# Altium schematic sheet MAX6698-Temperature-Sensor.SchDoc: MAX6698 Temperature Sensor
size Letter; Author: Tharun Suresh; CompanyName: AlbertaSat; Organization: Altium Limited; Revision: 4.1; SheetNumber: 3; SheetTotal: 4; CopyrightYear: 2019
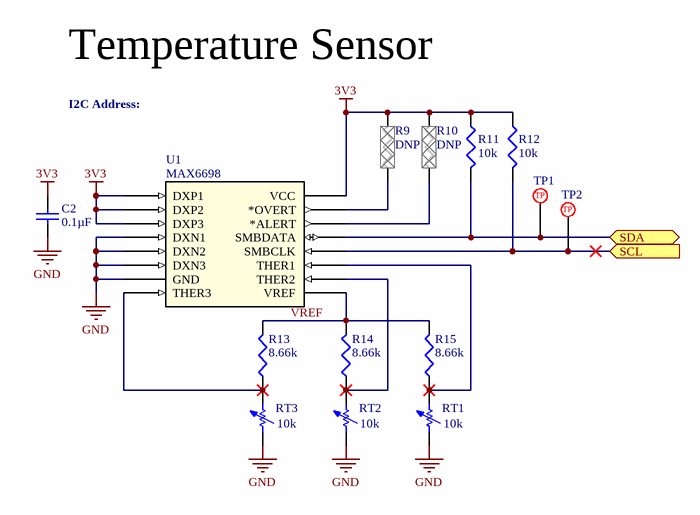
[diagram p0: MAX6698-Temperature-Sensor.SchDoc]

## Parts
C2  value 0.1µF  [TDK-CGA2B]  (hidden comment: Cap)
R9  DNP  [PANA-ERJ2G]  (no BOM)
R10  DNP  [PANA-ERJ2G]  (no BOM)
R11  value 10k  [PANA-ERJ6EN]  (hidden comment: Res3)
R12  value 10k  [PANA-ERJ6EN]  (hidden comment: Res3)
R13  value 8.66k  [PANA-ERA2A]  (hidden comment: Res3)
R14  value 8.66k  [PANA-ERA2A]  (hidden comment: Res3)
R15  value 8.66k  [PANA-ERA2A]  (hidden comment: Res3)
RT1  value 10k  [VSH-1M1002]  (hidden comment: Res Adj1)
RT2  value 10k  [VSH-1M1002]  (hidden comment: Res Adj1)
RT3  value 10k  [VSH-1M1002]  (hidden comment: Res Adj1)
TP1  5017  [KS-5017]  (value not drawn)
TP2  5017  [KS-5017]  (value not drawn)
U1  MAX6698  [MAX-21-0055H-16]

## Ports
SCL (in), SDA (bidir)

## Nets
3V3: C2.2 R9.2 R10.2 R11.1 R12.1 U1.1(DXP1) U1.3(DXP2) U1.5(DXP3) U1.12(VCC)
GND: C2.1 RT1.1 RT2.1 RT3.1 U1.2(DXN1) U1.4(DXN2) U1.6(DXN3) U1.16(GND)
SCL: R12.2 TP2.1 U1.15(SMBCLK) ; port SCL
SDA: R11.2 TP1.1 U1.14(SMBDATA) ; port SDA
VREF: R13.2 R14.2 R15.2 U1.8(VREF)
NetR9_1: R9.1 U1.11(*OVERT)
NetR10_1: R10.1 U1.13(*ALERT)
NetR13_1: R13.1 RT3.2 U1.7(THER3)
NetR14_1: R14.1 RT2.2 U1.9(THER2)
NetR15_1: R15.1 RT1.2 U1.10(THER1)

## Notes on the sheet
- Temperature Sensor
- I2C Address:
- (the "License"); you may not use or redistribute this file except in compliance with the License. You
- This file and the information within it are licensed under the terms of the Apache License, Version 2.0
- Copyright
- Unless required by applicable law or agreed to in writing, content distributed under the License is
- distributed on an "AS IS" BASIS, WITHOUT WARRANTIES OR CONDITIONS OF ANY KIND,
- either express or implied. See the License for the specific language governing permissions and
- limitations under the License.
- may obtain a copy of the License at:
- http://www.apache.org/licenses/LICENSE-2.0
- Title
- Size:
- Date:
- Letter
- Number:
- Time:
- Revision:
- Sheet
- of
- University of Alberta
- Deptartment of Electrical
- and Computer Engineering
- Edmonton AB, Canada
- T6G 1H9
- File:
- (in symbol PTP-KS-00001) TP

## Library data of the parts
C2 = PC-TDK-02262: CAP CER 0.1UF 50V X7R 0402; Manufacturer Part Number: CGA2B3X7R1H104M050BB; Index: 2262; Designator: C?; Tolerance: ±20%; Published: 3/16/2016; LatestRevisionDate: 3/16/2016; LatestRevisionNote: ...; PackageReference: 0402 (1005 Metric); Publisher: AlbertaSat; PackageDescription: Radial Cap, Thru-Hole; 2 Leads; 0.3 in Pin Spacing; Part Number: PC-TDK-02262; Supplier Part Number 1: 445-12271-1-ND; Supplier 1: Digi-key; Supplier Link: http://www.digikey.ca/product-search/en?keywords=445-12271-1-ND; Voltage - Rated: 50V; Temperature Coefficient: X7R; Applications: Automotive
R9 R10 = 19766: Part Number: 19766; Designator: R?; Value: DNP; PackageReference: 0402 (1005 Metric); PackageDescription: Chip Resistor, 2-Leads, Body 1.00x0.50mm, IPC Low Density
R11 R12 = 17208: RES SMD 10K OHM 1% 1/8W 0805; Part Number: 17208; Manufacturer Part Number: ERJ-6ENF1002V; Power: 0.125W, 1/8W; Temperature Coefficient: ±100ppm/°C; Published: 8-Jun-2000; LatestRevisionDate: 29-May-2009; LatestRevisionNote: IPC-7351 Footprint Added.; PackageReference: 0805 (2012 Metric); Publisher: Altium Limited; PackageDescription: Chip Resistor, 2-Leads, Body 2.00x1.25mm, IPC Low Density; Supplier Part Number 1: P10.0KCCT-ND; Supplier 1: Digi-Key; Supplier Link: https://www.digikey.com/product-detail/en/panasonic-electronic-components/ERJ-6ENF1002V/P10.0KCCT-ND/119248; Tolerance: ±1%
R13-R15 = 17098: RES SMD 8.66KOHM 0.1% 1/16W 0402; Part Number: 17098; Manufacturer Part Number: ERA-2ARB8661X; Designator: R?; Power: 0.063W, 1/16W; Temperature Coefficient: ±10ppm/°C; Published: 8-Jun-2000; LatestRevisionDate: 29-May-2009; LatestRevisionNote: IPC-7351 Footprint Added.; PackageReference: 0402 (1005 Metric); Publisher: Altium Limited; PackageDescription: Chip Resistor, 2-Leads, Body 1.00x0.50mm, IPC Low Density; Supplier Part Number 1: P18123CT-ND; Supplier 1: Digi-Key; Supplier Link: http://www.digikey.ca/product-search/en?keywords=P18123CT-ND; Tolerance: ±0.1%
RT1-RT3 = PRT-VSH-00266: NTC THERMISTOR 10K OHM 5% BEAD; Manufacturer Part Number: 01M1002JF; Set Position: 0.5; Index: 266; Power - Rated: 75mW; Published: 5/26/2018; LatestRevisionDate: 5/26/2018; LatestRevisionNote: ...; PackageReference: VSH-1M1002; Publisher: AlbertaSat; PackageDescription: NTC THERMISTOR 10K OHM 5% BEAD; Part Number: PRT-VSH-00266; Supplier Part Number 1: 541-1074-ND; Supplier 1: Digi-key; Supplier Part Number 2: 71-1M1002-A3; Supplier 2: Mouser; Supplier Link: https://www.digikey.ca/product-detail/en/vishay-dale/01M1002JF/541-1074-ND/1427053; Tolerance: ±5%
TP1 TP2 = PTP-KS-00001: PC TEST POINT MINI SMD; Index: 1; Supplier 1: Digi-key; Supplier 2: Newark; Supplier 3: Mouser; Part Number: PTP-KS-00001; Manufacturer Part Number: 5017; Supplier Part Number 1: 36-5017CT-ND; Publisher: AlbertaSat; Published: 3/15/2016; LatestRevisionDate: 3/15/2016; LatestRevisionNote: ...; PackageReference: KS-5017; PackageDescription: Testpoint Lug Mini SMD 27X10X152; Supplier Link: http://www.digikey.ca/product-detail/en/keystone-electronics/5017/36-5017TR-ND/2217304
U1 = PU-MAX-00004: SENSOR TEMPERATURE SMBUS 16QSOP; Index: 4; Part Number: PU-MAX-00004; Manufacturer Part Number: MAX6698EE38+T; Supplier Part Number 1: MAX6698EE38+TCT-ND; Supplier 1: Digi-key; Publisher: AlbertaSat; Published: 6/7/2018; LatestRevisionDate: 6/7/2018; LatestRevisionNote: ...; PackageReference: 16-QSOP; PackageDescription: QSOP, 16-Leads,; Supplier Link: https://www.digikey.ca/product-detail/en/maxim-integrated/MAX6698EE38-T/MAX6698EE38-TCT-ND/2776890